# Altium schematic sheet Display.SchDoc: Display
size A4; SheetNumber: 5; SheetTotal: 5
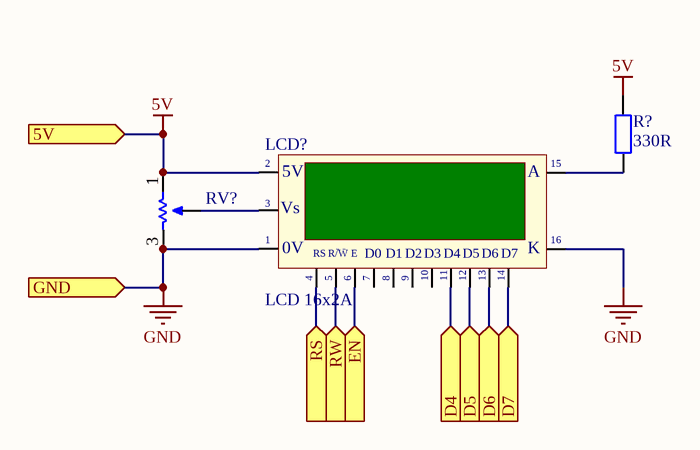
[diagram p0: Display.SchDoc]

## Parts
LCD?  LCD 16x2A  [LCD16X2]
R?  330R  [RES-SMD-0805]
RV?  RV20K  [RVAR10K]  (value not drawn)

## Ports
5V (in), D4 (in), D5 (in), D6 (in), D7 (in), EN (in), GND (in), RS (in), RW (in)

## Nets
5V: LCD?.2(VDD) R?.2 RV?.1 ; port 5V
GND: LCD?.1(GND) LCD?.16(K) RV?.3 ; port GND
D4: LCD?.11(D4) ; port D4
D5: LCD?.12(D5) ; port D5
D6: LCD?.13(D6) ; port D6
D7: LCD?.14(D7) ; port D7
EN: LCD?.6(~{EN}) ; port EN
RS: LCD?.4(RS) ; port RS
RW: LCD?.5(R/~{W}) ; port RW
NetLCD?_3: LCD?.3(VEE) RV?.2
NetLCD?_15: LCD?.15(A) R?.1

Not connected (* = marked no-connect by the designer): LCD? 7(D0) 8(D1) 9(D2) 10(D3)

## Notes on the sheet
- Document Title:
- ĐH BKHN
- Project Name:
- Size:
- A4
- Reviewer:
- Designer:
- Nguyen Ba Hoang
- Revision:
- 1 Dai Co Viet Street
- Bach Khoa, Hai Ba Trung
- Ha Noi
- File:
- Sheet:
- of
- Date:
- (in symbol LCD16x2A) 5V; Vs; |; 0V; R/W; E

## Library data of the parts
LCD? = LCD16x2A: LCD dipslay 16 char, 2 line; Available: *
R? = R1/4W: Resistor 1/4W; Supplier Part Num: Điện Trở 330 Ohm 0805 5%
RV? = Variable Resistor: Available: *